# EAGLE design ac_meter (EAGLE 5.11)
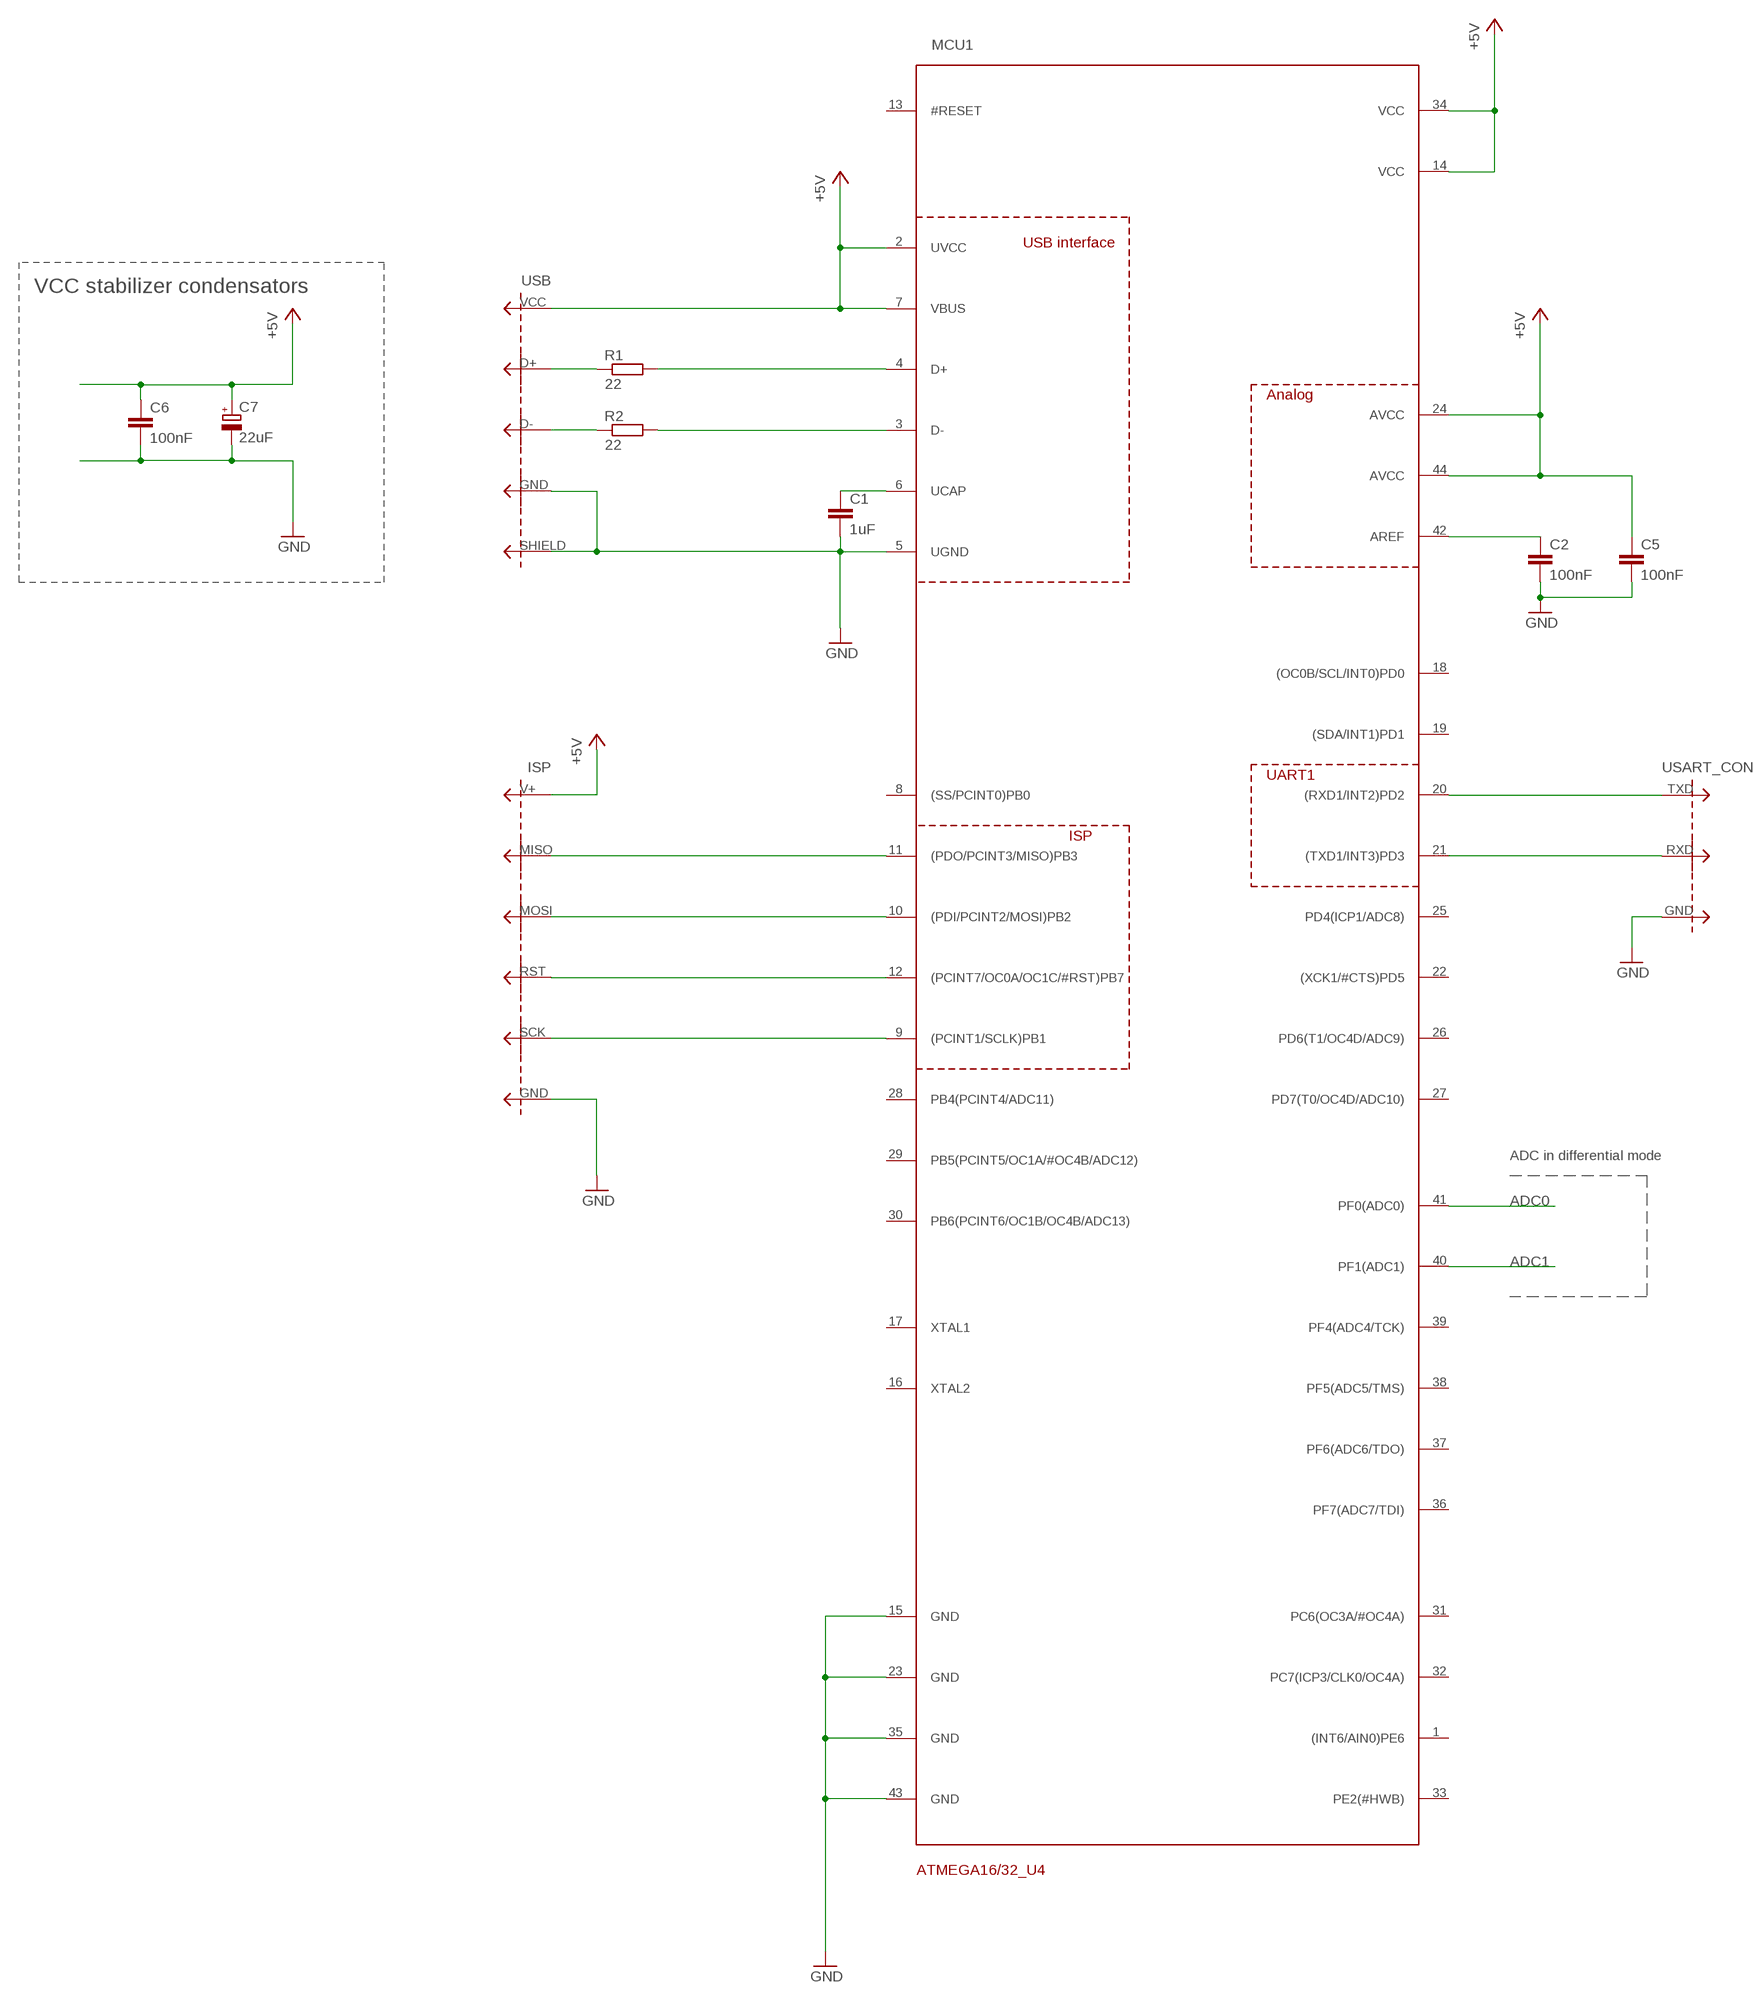
[diagram p0: schematic, sheet 1, part 1 of 2]
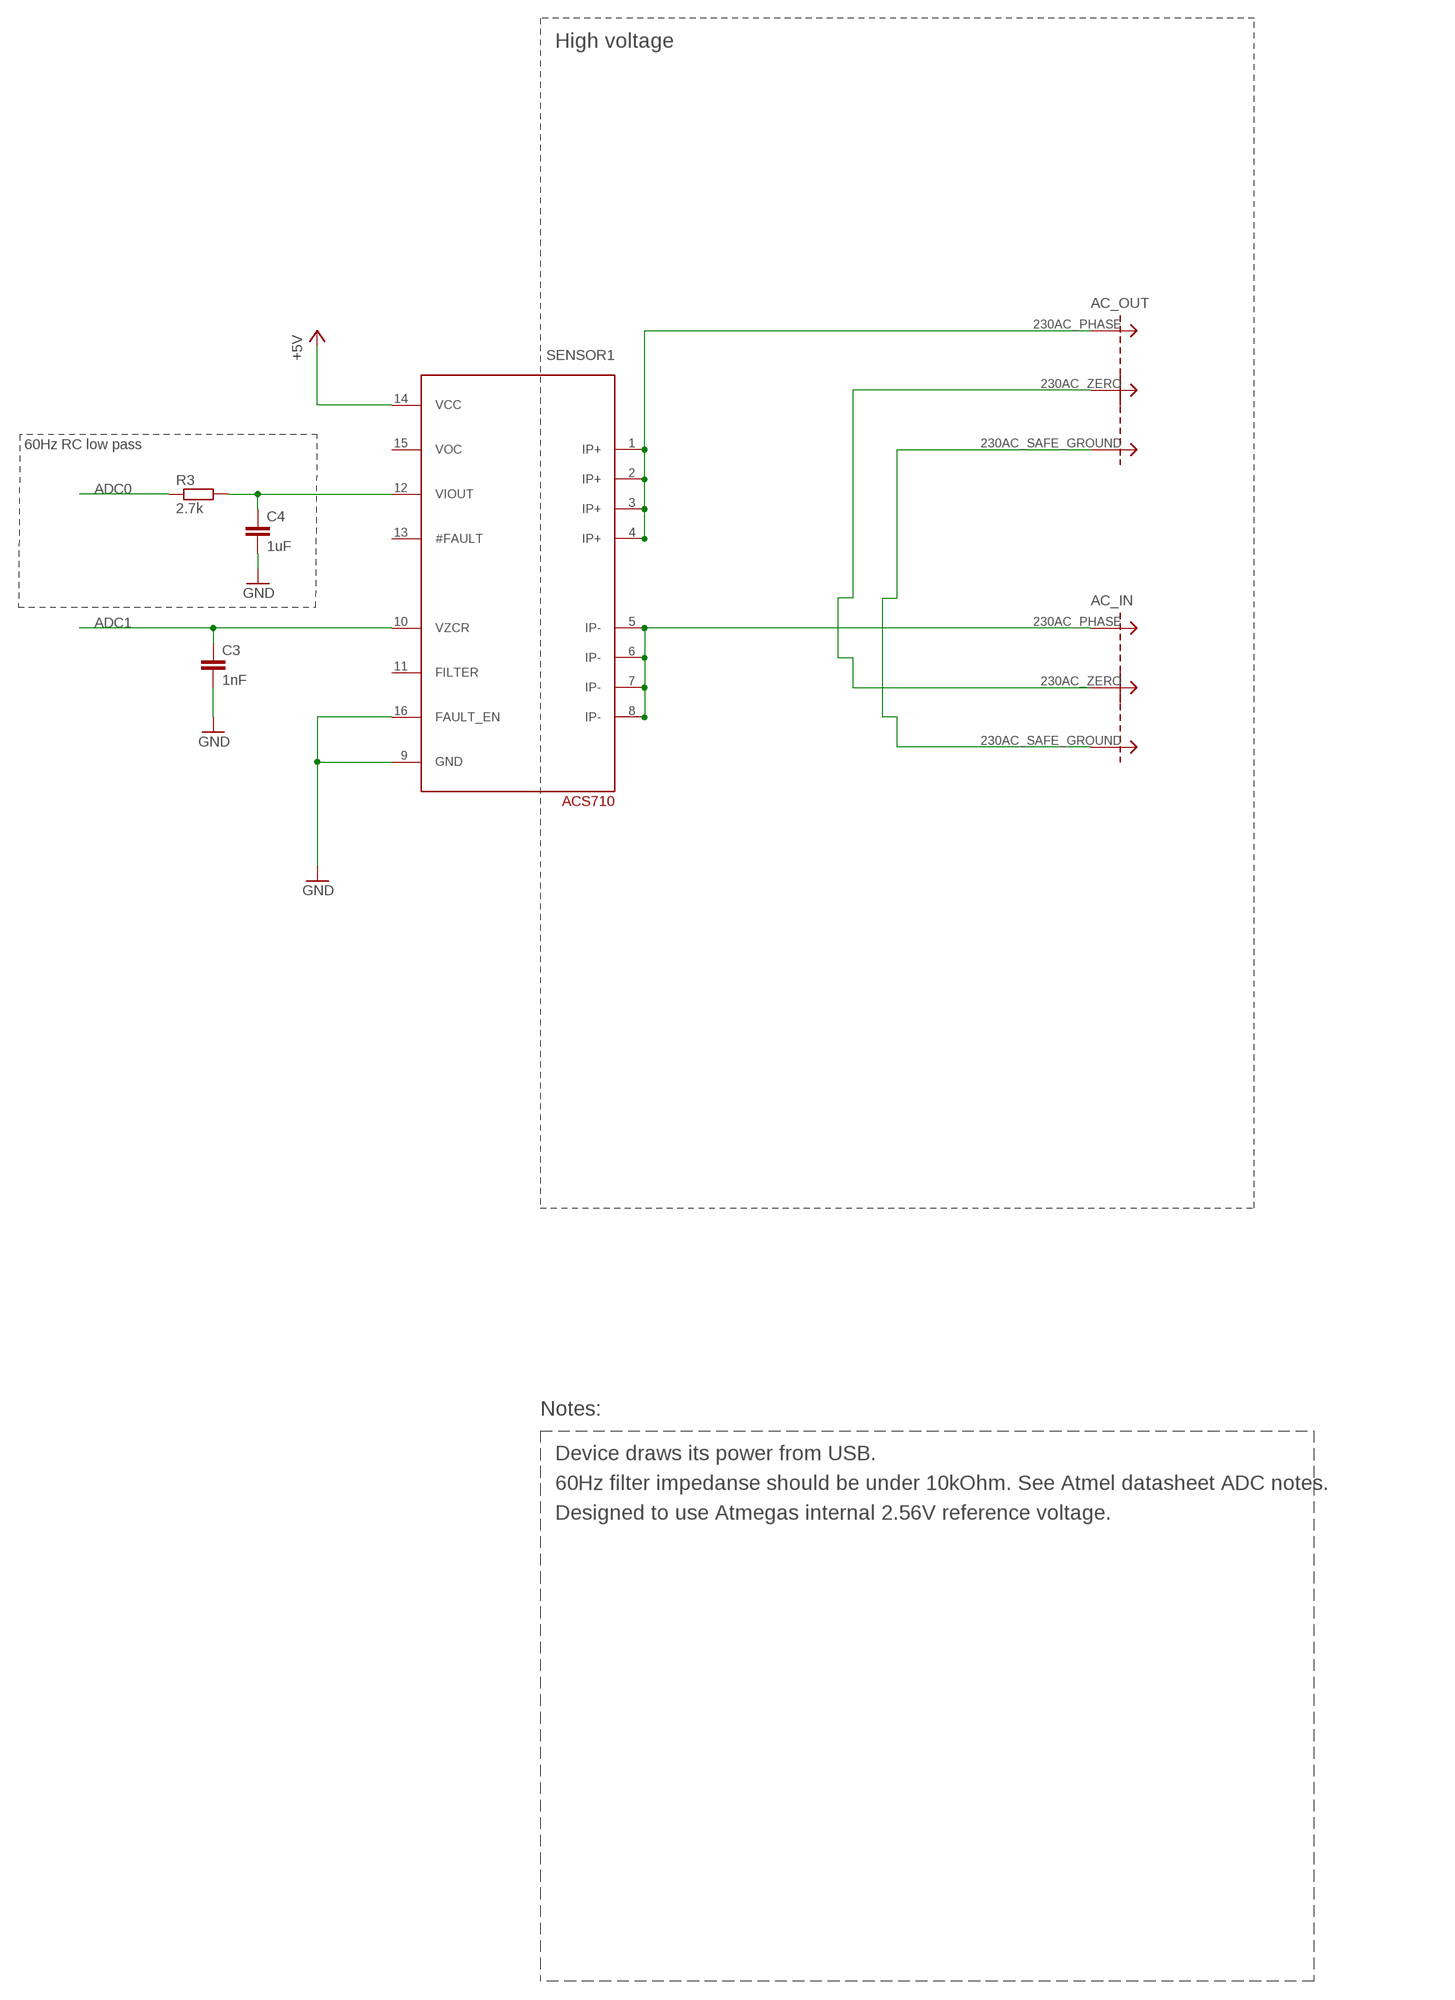
[diagram p1: schematic, sheet 1, part 2 of 2]

## Parts
AC_IN  CONNECTOR_3PINMAINS_SOLDER_PADS  [1X3_MAINS_SOLDER_PADS]
AC_OUT  CONNECTOR_3PINMAINS_SOLDER_PADS  [1X3_MAINS_SOLDER_PADS]
C1  1uF  C-EUC1206  [C1206]
C2  100nF  C-EUC1206  [C1206]
C3  1nF  C-EUC1206  [C1206]
C4  1uF  C-EUC1206  [C1206]
C5  100nF  C-EUC1206  [C1206]
C6  100nF  C-EUC1206  [C1206]
C7  22uF  CPOL-EUE2.5-6  [E2,5-6]
ISP  CONNECTOR_6PIN2X3_ISP  [2X3_ISP]
MCU1  ATMEGA16/32_U4  [TQFP44]
R1  22  R-EU_0207/10  [0207/10]
R2  22  R-EU_0207/10  [0207/10]
R3  2.7k  R-EU_0207/10  [0207/10]
SENSOR1  ACS710_CURRENT_SENSOR  [SO-16W]
USART_CON  CONNECTOR_3PINUSART  [1X3_USART]
USB  CONNECTOR_5PINUSB_SMD  [1X5_USB]

## Nets
+5V: C5.1 C6.1 C7.+ ISP.V+ MCU1.2(UVCC) MCU1.7(VBUS) MCU1.14(VCC) MCU1.24(AVCC) MCU1.34(VCC) MCU1.44(AVCC) SENSOR1.14(VCC) USB.VCC
ADC0: MCU1.41(PF0(ADC0)) R3.1
ADC1: C3.1 MCU1.40(PF1(ADC1)) SENSOR1.10(VZCR)
GND: C1.2 C2.2 C3.2 C4.2 C5.2 C6.2 C7.- ISP.GND MCU1.5(UGND) MCU1.15(GND) MCU1.23(GND) MCU1.35(GND) MCU1.43(GND) SENSOR1.9(GND) SENSOR1.16(FAULT_EN) USART_CON.GND USB.GND USB.SHIELD
N$1: ISP.MISO MCU1.11((PDO/PCINT3/MISO)PB3)
N$2: ISP.MOSI MCU1.10((PDI/PCINT2/MOSI)PB2)
N$3: ISP.RST MCU1.12((PCINT7/OC0A/OC1C/#RST)PB7)
N$4: ISP.SCK MCU1.9((PCINT1/SCLK)PB1)
N$5: R1.1 USB.D+
N$6: R2.1 USB.D-
N$7: MCU1.3(D-) R2.2
N$8: MCU1.4(D+) R1.2
N$9: C1.1 MCU1.6(UCAP)
N$10: C4.1 R3.2 SENSOR1.12(VIOUT)
N$11: C2.1 MCU1.42(AREF)
N$12: MCU1.20((RXD1/INT2)PD2) USART_CON.TXD
N$13: MCU1.21((TXD1/INT3)PD3) USART_CON.RXD
PHASE_IN: AC_IN.230AC_PHASE SENSOR1.5(IP-) SENSOR1.6(IP-) SENSOR1.7(IP-) SENSOR1.8(IP-)
PHASE_OUT: AC_OUT.230AC_PHASE SENSOR1.1(IP+) SENSOR1.2(IP+) SENSOR1.3(IP+) SENSOR1.4(IP+)
SAFE_GROUND: AC_IN.230AC_SAFE_GROUND AC_OUT.230AC_SAFE_GROUND
ZERO: AC_IN.230AC_ZERO AC_OUT.230AC_ZERO
Unconnected: MCU1.1((INT6/AIN0)PE6) MCU1.8((SS/PCINT0)PB0) MCU1.13(#RESET) MCU1.16(XTAL2) MCU1.17(XTAL1) MCU1.18((OC0B/SCL/INT0)PD0) MCU1.19((SDA/INT1)PD1) MCU1.22((XCK1/#CTS)PD5) MCU1.25(PD4(ICP1/ADC8)) MCU1.26(PD6(T1/OC4D/ADC9)) MCU1.27(PD7(T0/OC4D/ADC10)) MCU1.28(PB4(PCINT4/ADC11)) MCU1.29(PB5(PCINT5/OC1A/#OC4B/ADC12)) MCU1.30(PB6(PCINT6/OC1B/OC4B/ADC13)) MCU1.31(PC6(OC3A/#OC4A)) MCU1.32(PC7(ICP3/CLK0/OC4A)) MCU1.33(PE2(#HWB)) MCU1.36(PF7(ADC7/TDI)) MCU1.37(PF6(ADC6/TDO)) MCU1.38(PF5(ADC5/TMS)) MCU1.39(PF4(ADC4/TCK)) SENSOR1.11(FILTER) SENSOR1.13(#FAULT) SENSOR1.15(VOC)

## Notes on the sheet
- High voltage
- 60Hz RC low pass
- VCC stabilizer condensators
- Notes:
- ADC in differential mode
- Device draws its power from USB.
- 60Hz filter impedanse should be under 10kOhm. See Atmel datasheet ADC notes.
- Designed to use Atmegas internal 2.56V reference voltage.

## Library data of the parts
AC_IN AC_OUT USART_CON = connectors:CONNECTOR_3PIN
C1-C6 = RC_and_L:C-EU: CAPACITOR, European symbol
C7 = RC_and_L:CPOL-EU: POLARIZED CAPACITOR, European symbol
ISP = connectors:CONNECTOR_6PIN
MCU1 = project_specific_parts:ATMEGA16/32_U4
R1-R3 = RC_and_L:R-EU_: RESISTOR, European symbol
SENSOR1 = project_specific_parts:ACS710_CURRENT_SENSOR
USB = connectors:CONNECTOR_5PIN

## Board
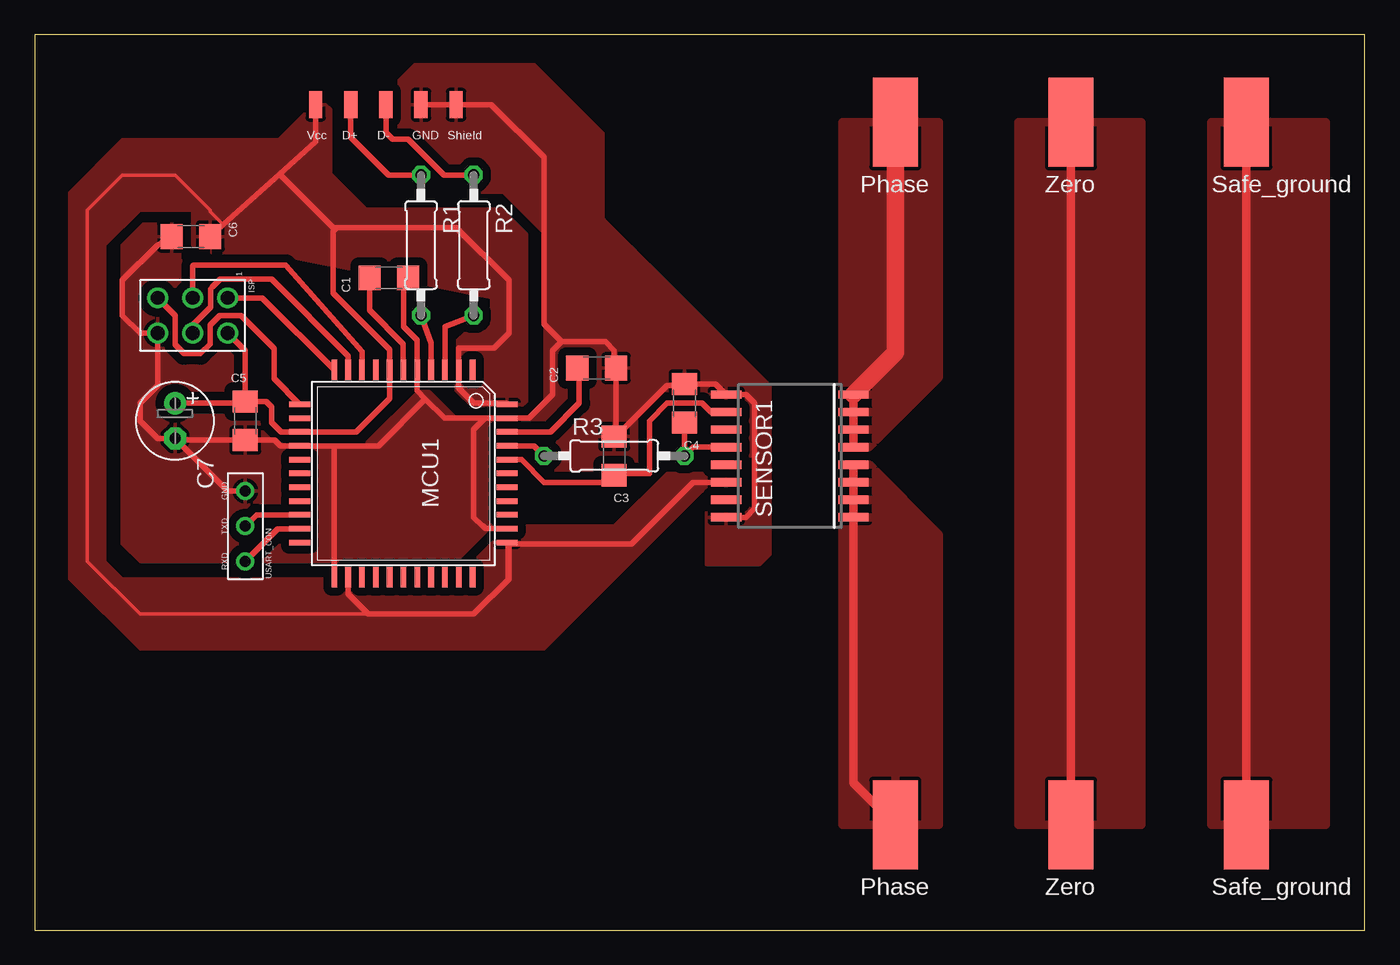
[diagram p2: board, top side]

Size 96.19 x 64.76 mm. Coordinates in mm from the lower left corner, seen from the top.
Outline: 0,0 96.19,0 96.19,64.76 0,64.76 0,0
Copper layers (1*16): Top 0.035mm / dielectric 1.5mm / Bottom 0.035mm
Design rules "default *": minimum track width 10mil, minimum drill 24mil, track to track 0.6mm, track to pad 0.6mm, pad to pad 8mil, via to via 8mil, smd to smd 8mil, copper to edge 40mil, drill to drill 8mil, minimum pad ring 10mil, minimum via ring 8mil, stop-mask expansion 4mil, vias tented up to drill 0mil, thermal gap 10mil

### Footprints (pad centres in the part's own frame; a part is rotated, then mirrored left to right if it is on the bottom)
1X3_MAINS_SOLDER_PADS = smd 3.251 x 6.452: 230AC_PHASE -12.7,0; 230AC_SAFE_GROUND 12.7,0; 230AC_ZERO 0,0
C1206 = smd 1.6 x 1.8: 1 -1.4,0; 2 1.4,0
E2,5-6 = drill 0.813 pad 1.6 round: + -1.27,0 | drill 0.813 pad 1.6 octagon: - 1.27,0
2X3_ISP = drill 1 round: GND 1.27,-5.08; MISO -1.27,0; MOSI 1.27,-2.54; RST -1.27,-5.08; SCK -1.27,-2.54; V+ 1.27,0
TQFP44 = smd 1.5 x 0.4: 1 -7.5,5; 2 -7.5,4; 3 -7.5,3; 4 -7.5,2; 5 -7.5,1; 6 -7.5,0; 7 -7.5,-1; 8 -7.5,-2; 9 -7.5,-3; 10 -7.5,-4; 11 -7.5,-5; 23 7.5,-5; 24 7.5,-4; 25 7.5,-3; 26 7.5,-2; 27 7.5,-1; 28 7.5,0; 29 7.5,1; 30 7.5,2; 31 7.5,3; 32 7.5,4; 33 7.5,5 | smd 0.4 x 1.5: 12 -5,-7.5; 13 -4,-7.5; 14 -3,-7.5; 15 -2,-7.5; 16 -1,-7.5; 17 0,-7.5; 18 1,-7.5; 19 2,-7.5; 20 3,-7.5; 21 4,-7.5; 22 5,-7.5; 34 5,7.5; 35 4,7.5; 36 3,7.5; 37 2,7.5; 38 1,7.5; 39 0,7.5; 40 -1,7.5; 41 -2,7.5; 42 -3,7.5; 43 -4,7.5; 44 -5,7.5
0207/10 = drill 0.813 octagon: 1 -5.08,0; 2 5.08,0
SO-16W = smd 0.6 x 2.2: 1 -4.445,-4.6; 2 -3.175,-4.6; 3 -1.905,-4.6; 4 -0.635,-4.6; 5 0.635,-4.6; 6 1.905,-4.6; 7 3.175,-4.6; 8 4.445,-4.6; 9 4.445,4.6; 10 3.175,4.6; 11 1.905,4.6; 12 0.635,4.6; 13 -0.635,4.6; 14 -1.905,4.6; 15 -3.175,4.6; 16 -4.445,4.6
1X3_USART = drill 0.8 round: GND 2.54,0; RXD -2.54,0; TXD 0,0
1X5_USB = smd 0.965 x 1.93: D+ 0,0; D- 2.54,0; GND 5.08,0; SHIELD 7.62,0; VCC -2.54,0

### Placement (x,y rotation side)
AC_IN  74.93,58.42 0 top
AC_OUT  74.93,7.62 0 top
C1  25.61,47.16 0 top
C2  40.64,40.64 0 top
C3  41.91,34.29 90 top
C4  46.99,38.1 90 top
C5  15.24,36.83 270 top
C6  11.3,50.15 180 top
C7  10.16,36.83 270 top
ISP  13.97,44.45 270 top
MCU1  26.67,33.02 270 top
R1  27.94,49.53 270 top
R2  31.75,49.53 270 top
R3  41.91,34.29 0 top
SENSOR1  54.61,34.29 90 top
USART_CON  15.24,29.21 90 top
USB  22.86,59.69 0 top

### Tracks (layer width: path | path; a pad name or v marks a point on that pad's centre or on a via)
+5V
  Top 0.254: MCU1.34 34.17,25.28 31.75,22.86 7.62,22.86 3.81,26.67 3.81,52.07 6.35,54.61 10.16,54.61 12.7,52.07 12.7,51.97 13.65,51.01
  Top 0.406: MCU1.44 34.09,38.1 31.75,38.1 30.67,39.18 MCU1.2 30.67,42.1 33.21,42.1 34.29,43.18 34.29,46.99 30.48,50.8 21.83,50.8 | USB.VCC 20.32,57.02 17.72,54.68 | 17.72,54.68 13.65,51.01 C6.1 | C7.+ 15.11,38.1 C5.1 | C5.1 15.24,41.91 ISP.V+ | C5.1 16.75,38.23 17.16,37.82 17.16,36.69 17.82,36.02 MCU1.14 23.26,36.02 25.67,38.43 MCU1.7 25.67,41.96 21.57,46.06 21.57,50.54 21.83,50.8 | 21.83,50.8 21.6,50.8 17.72,54.68 | SENSOR1.14 47.62,32.38 43.18,27.94 34.25,27.94 MCU1.34 34.29,27.9 34.29,25.4 31.75,22.86 24.13,22.86 22.67,24.32 MCU1.24
  pour Top: 20.32,59.69 20.17,59.69 12.82,52.34 12.82,49.01 12.79,48.98 16.94,48.98 33.06,45.74 33.06,43.74 32.6,43.29 31.22,43.29 30.48,42.54 30.48,39.03 31.7,37.81 35.16,37.81 35.58,38.23 35.58,50.34 33.77,52.15 23.96,52.15 21.41,54.7 21.41,59.36 21.06,59.71 20.34,59.71
  pour Top: 34.29,29.21 41.91,29.21 45.72,33.02 50.8,33.02 50.8,31.75 48.26,31.75 36.83,20.32 7.62,20.32 2.54,25.4 2.54,53.34 6.35,57.15 17.78,57.15 17.78,49.53 11.43,49.53 11.43,52.07 7.62,52.07 5.08,49.53 5.08,26.67 6.35,25.4 31.75,25.4 31.75,26.67
ADC0
  Top 0.406: MCU1.41 36.1,35.02 R3.1
ADC1
  Top 0.406: SENSOR1.10 48.9,37.47 48.26,38.1 45.72,38.1 44.45,36.83 44.45,33.02 42.04,33.02 C3.1 41.41,32.38 36.83,32.38 35.2,34.02 MCU1.40
GND
  Top 0.406: SENSOR1.16 51.44,29.84 52.07,30.48 52.07,38.1 51.44,38.73 SENSOR1.9 49.24,39.5 C4.2 46.86,39.37 45.72,39.37 42.04,35.69 C3.2 42.04,35.82 C2.2 41.91,40.77 41.91,41.91 41.27,42.55 38.1,42.55 | MCU1.43 35.75,37.02 37.47,38.73 37.47,41.91 38.1,42.55 | MCU1.43 32.58,37.02 31.75,36.2 31.75,29.84 32.38,29.21 32.44,29.21 32.62,29.03 MCU1.35 | MCU1.43 29.64,37.02 28.25,38.41 | 28.25,38.41 27.66,39 MCU1.5 27.67,42.67 26.7,43.65 26.7,46.85 C1.2 | 38.1,42.55 36.83,43.81 36.83,55.88 33.02,59.69 USB.SHIELD USB.GND | C7.- 10.29,35.43 C5.2 17.37,35.43 17.78,35.02 MCU1.15 21.62,35.02 | MCU1.23 21.67,34.97 21.62,35.02 | USART_CON.GND 13.97,31.75 C7.- | C6.2 8.89,49.53 6.35,46.99 6.35,44.45 7.62,43.18 ISP.GND 8.89,39.37 7.62,38.1 7.62,36.83 8.89,35.56 C7.- | 21.62,35.02 24.86,35.02 28.25,38.41
  pour Top: 7.87,51.05 6.35,49.53 6.35,27.94 7.62,26.67 30.48,26.67 34.29,30.48 41.91,30.48 45.72,34.29 52.07,34.29 52.07,30.48 48.83,30.48 48.57,30.23 48.57,26.47 48.55,26.44 52.45,26.44 53.19,27.18 53.19,39.37 41.1,51.46 41.1,57.63 36.13,62.59 27.49,62.59 26.34,61.44 26.34,56.11 29.1,53.35 33.88,53.35 36.92,50.31 36.92,38.13 35.63,36.84 26.66,36.84 24.73,34.91 19.31,34.91 19.22,35 19.22,37.3 19.81,37.9 21.88,37.9 24.23,40.24 24.23,40.24 17.1,47.37 11.63,47.37 10.48,48.52 10.48,50.87 10.3,51.05
  pour Top: 24.13,34.29 24.13,35.22 27.79,38.87 28.48,38.87 31.04,36.31 31.04,34.17 24.25,34.17
N$1
  Top 0.406: ISP.MISO 16.47,45.72 MCU1.11
N$2
  Top 0.406: MCU1.10 22.67,41.52 17.13,47.06 13.43,47.06 12.85,46.49 12.85,46.48 12.74,46.37 12.74,45.05 11.43,43.74 ISP.MOSI
N$3
  Top 0.406: ISP.RST 8.89,45.7 10.17,44.42 10.17,42.33 10.81,41.69 11.99,41.69 12.69,42.39 12.69,43.75 13.38,44.44 14.94,44.42 17.31,42.05 17.31,39.88 MCU1.12
N$4
  Top 0.406: MCU1.9 23.67,41.82 18.17,48.08 18.16,48.08 11.51,48.08 11.43,48 ISP.SCK
N$5
  Top 0.406: R1.1 25.58,54.61 22.86,57.33 USB.D+
N$6
  Top 0.406: R2.1 29.6,54.61 27.02,57.19 25.89,57.19 25.4,57.68 USB.D-
N$7
  Top 0.406: MCU1.3 29.67,43.64 R2.2
N$8
  Top 0.406: MCU1.4 28.67,42.45 R1.2
N$9
  Top 0.406: C1.1 24.21,44.84 26.66,42.38 MCU1.6
N$10
  Top 0.406: SENSOR1.12 47.62,34.92 R3.2 C4.1
N$11
  Top 0.406: MCU1.42 37.29,36.02 39.37,38.1 39.37,40.51 C2.1
N$12
  Top 0.406: MCU1.20 16.05,30.02 USART_CON.TXD
N$13
  Top 0.406: MCU1.21 17.59,29.02 USART_CON.RXD
PHASE_IN
  Top 0.61: SENSOR1.5 SENSOR1.8
  Top 1.27: AC_IN.230AC_PHASE 62.23,41.76 SENSOR1.8
  pour Top: 65.41,58.42 58.42,58.42 58.42,34.92 60.33,34.92 65.41,40.01
PHASE_OUT
  Top 0.61: SENSOR1.4 SENSOR1.1 59.21,10.64 AC_OUT.230AC_PHASE
  pour Top: 65.41,7.62 58.42,7.62 58.42,33.66 60.33,33.66 65.41,28.57
SAFE_GROUND
  Top 0.61: AC_OUT.230AC_SAFE_GROUND AC_IN.230AC_SAFE_GROUND
  pour Top: 85.09,58.42 85.09,7.62 93.34,7.62 93.34,58.42
ZERO
  Top 0.61: AC_OUT.230AC_ZERO AC_IN.230AC_ZERO
  pour Top: 74.93,58.42 71.12,58.42 71.12,7.62 74.93,7.62 80.01,7.62 80.01,58.42